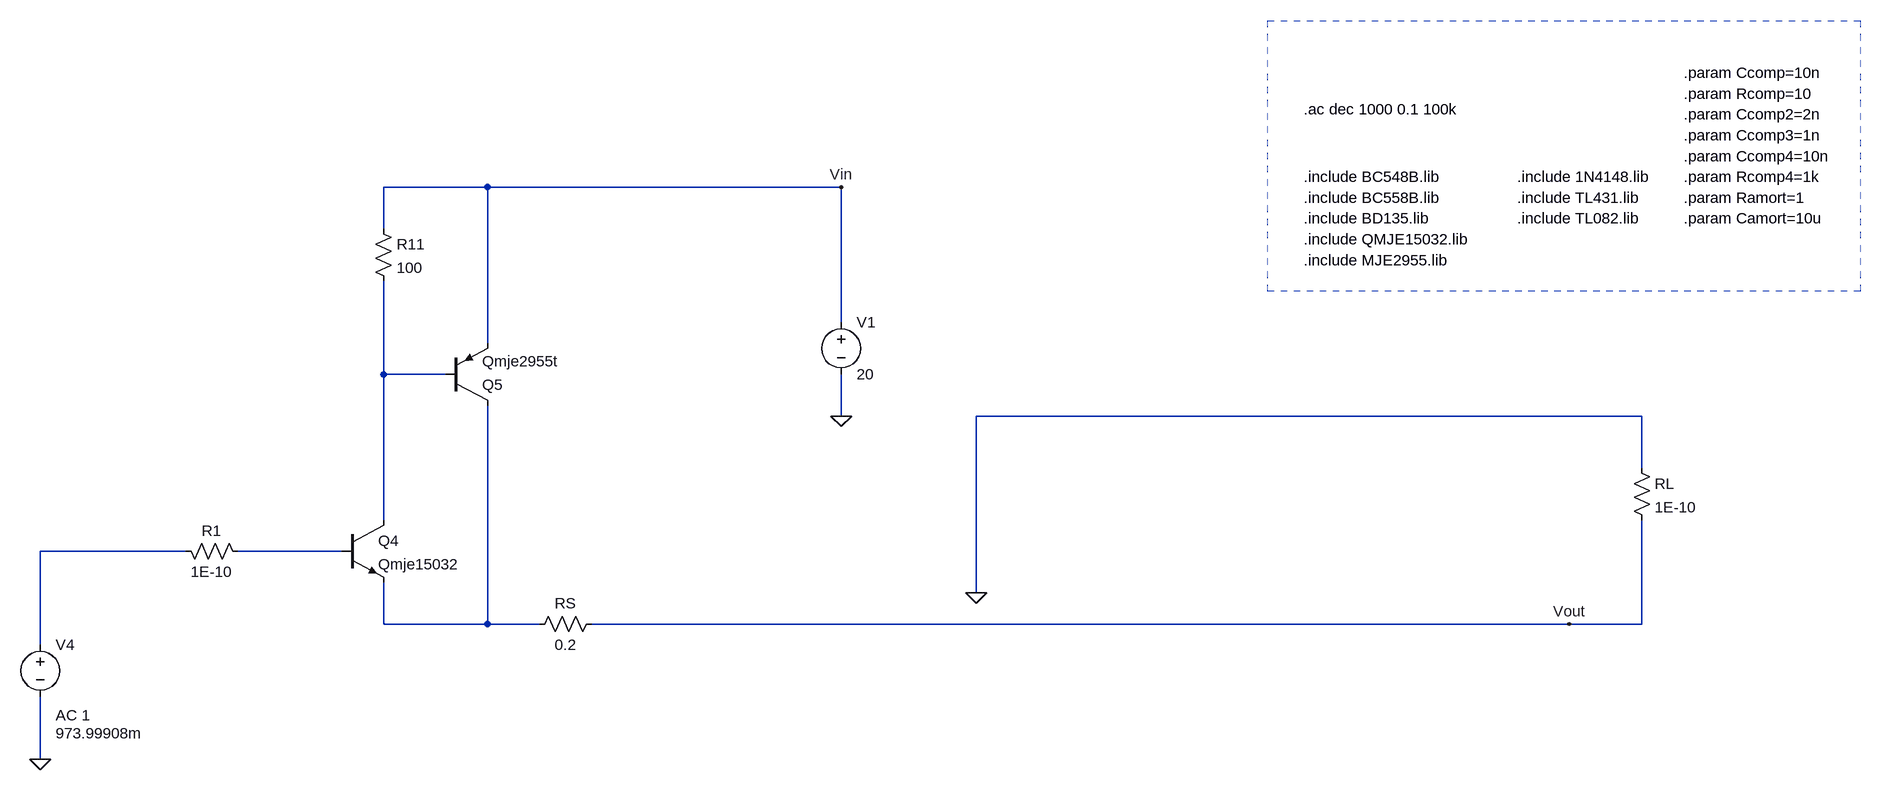
[diagram p0: schematic Measure-RiSziklai-RC.asc]
Measure-RiSziklai-RC.asc, the LTspice schematic file:
Version 4
SHEET 1 3040 1240
WIRE -384 -752 -544 -752
WIRE 160 -752 -384 -752
WIRE -544 -688 -544 -752
WIRE 160 -544 160 -752
WIRE -384 -512 -384 -752
WIRE -544 -464 -544 -608
WIRE -448 -464 -544 -464
WIRE 160 -400 160 -464
WIRE 1392 -400 368 -400
WIRE 1392 -320 1392 -400
WIRE -544 -240 -544 -464
WIRE -848 -192 -1072 -192
WIRE -608 -192 -768 -192
WIRE 368 -128 368 -400
WIRE -544 -80 -544 -144
WIRE -384 -80 -384 -416
WIRE -384 -80 -544 -80
WIRE -304 -80 -384 -80
WIRE 1280 -80 -224 -80
WIRE 1392 -80 1392 -240
WIRE 1392 -80 1280 -80
WIRE -1072 -48 -1072 -192
WIRE -1072 128 -1072 32
FLAG 160 -400 0
FLAG 368 -128 0
FLAG 1280 -80 Vout
FLAG 160 -752 Vin
FLAG -1072 128 0
DATAFLAG -128 -752 ""
DATAFLAG -544 -496 ""
DATAFLAG -384 -160 ""
DATAFLAG -384 -368 "Ic(Q5)"
DATAFLAG 1392 -208 "-I(RL)"
DATAFLAG 1088 -80 ""
DATAFLAG -544 -336 "Ic(Q4)"
DATAFLAG -192 -80 "I(Rs)"
DATAFLAG 128 -80 ""
DATAFLAG -1072 -128 ""
DATAFLAG -672 -192 ""
SYMBOL res -208 -96 R90
WINDOW 0 0 56 VBottom 2
WINDOW 3 32 56 VTop 2
SYMATTR InstName RS
SYMATTR Value 0.2
SYMBOL pnp -448 -416 M180
SYMATTR InstName Q5
SYMATTR Value Qmje2955t
SYMBOL voltage 160 -560 R0
SYMATTR InstName V1
SYMATTR Value 20
SYMBOL res -560 -704 R0
SYMATTR InstName R11
SYMATTR Value 100
SYMBOL npn -608 -240 R0
SYMATTR InstName Q4
SYMATTR Value Qmje15032
SYMBOL res 1376 -336 R0
SYMATTR InstName RL
SYMATTR Value 1E-10
SYMBOL voltage -1072 -64 R0
WINDOW 3 24 152 Left 2
WINDOW 123 24 124 Left 2
WINDOW 39 24 72 Left 2
SYMATTR Value 973.99908m
SYMATTR Value2 AC 1
SYMATTR InstName V4
SYMBOL res -864 -208 M90
WINDOW 0 0 56 VBottom 2
WINDOW 3 32 56 VTop 2
SYMATTR InstName R1
SYMATTR Value 1E-10
TEXT 872 -736 Left 2 !.include BC558B.lib
TEXT 1200 -704 Left 2 !.include TL082.lib
TEXT 872 -768 Left 2 !.include BC548B.lib
TEXT 872 -640 Left 2 !.include MJE2955.lib
TEXT 872 -704 Left 2 !.include BD135.lib
TEXT 1200 -768 Left 2 !.include 1N4148.lib
TEXT 1200 -736 Left 2 !.include TL431.lib
TEXT 872 -672 Left 2 !.include QMJE15032.lib
TEXT 872 -872 Left 2 !.ac dec 1000 0.1 100k
TEXT 1456 -928 Left 2 !.param Ccomp=10n
TEXT 1456 -896 Left 2 !.param Rcomp=10
TEXT 1456 -864 Left 2 !.param Ccomp2=2n
TEXT 1456 -832 Left 2 !.param Ccomp3=1n
TEXT 1456 -800 Left 2 !.param Ccomp4=10n
TEXT 1456 -736 Left 2 !.param Ramort=1
TEXT 1456 -704 Left 2 !.param Camort=10u
TEXT 1456 -768 Left 2 !.param Rcomp4=1k
RECTANGLE Normal 1728 -592 816 -1008 1

The netlist it stands for:
* Measure-RiSziklai-RC.asc
RS Vout N004 0.2
Q5 N004 N001 Vin 0 Qmje2955t
V1 Vin 0 20
R11 Vin N001 100
Q4 N001 N003 N004 0 Qmje15032
RL 0 Vout 1E-10
V4 N002 0 973.99908m AC 1
R1 N002 N003 1E-10
.model NPN NPN
.model PNP PNP
.lib standard.bjt
.include BC558B.lib
.include TL082.lib
.include BC548B.lib
.include MJE2955.lib
.include BD135.lib
.include 1N4148.lib
.include TL431.lib
.include QMJE15032.lib
.ac dec 1000 0.1 100k
.param Ccomp=10n
.param Rcomp=10
.param Ccomp2=2n
.param Ccomp3=1n
.param Ccomp4=10n
.param Ramort=1
.param Camort=10u
.param Rcomp4=1k
.backanno
.end